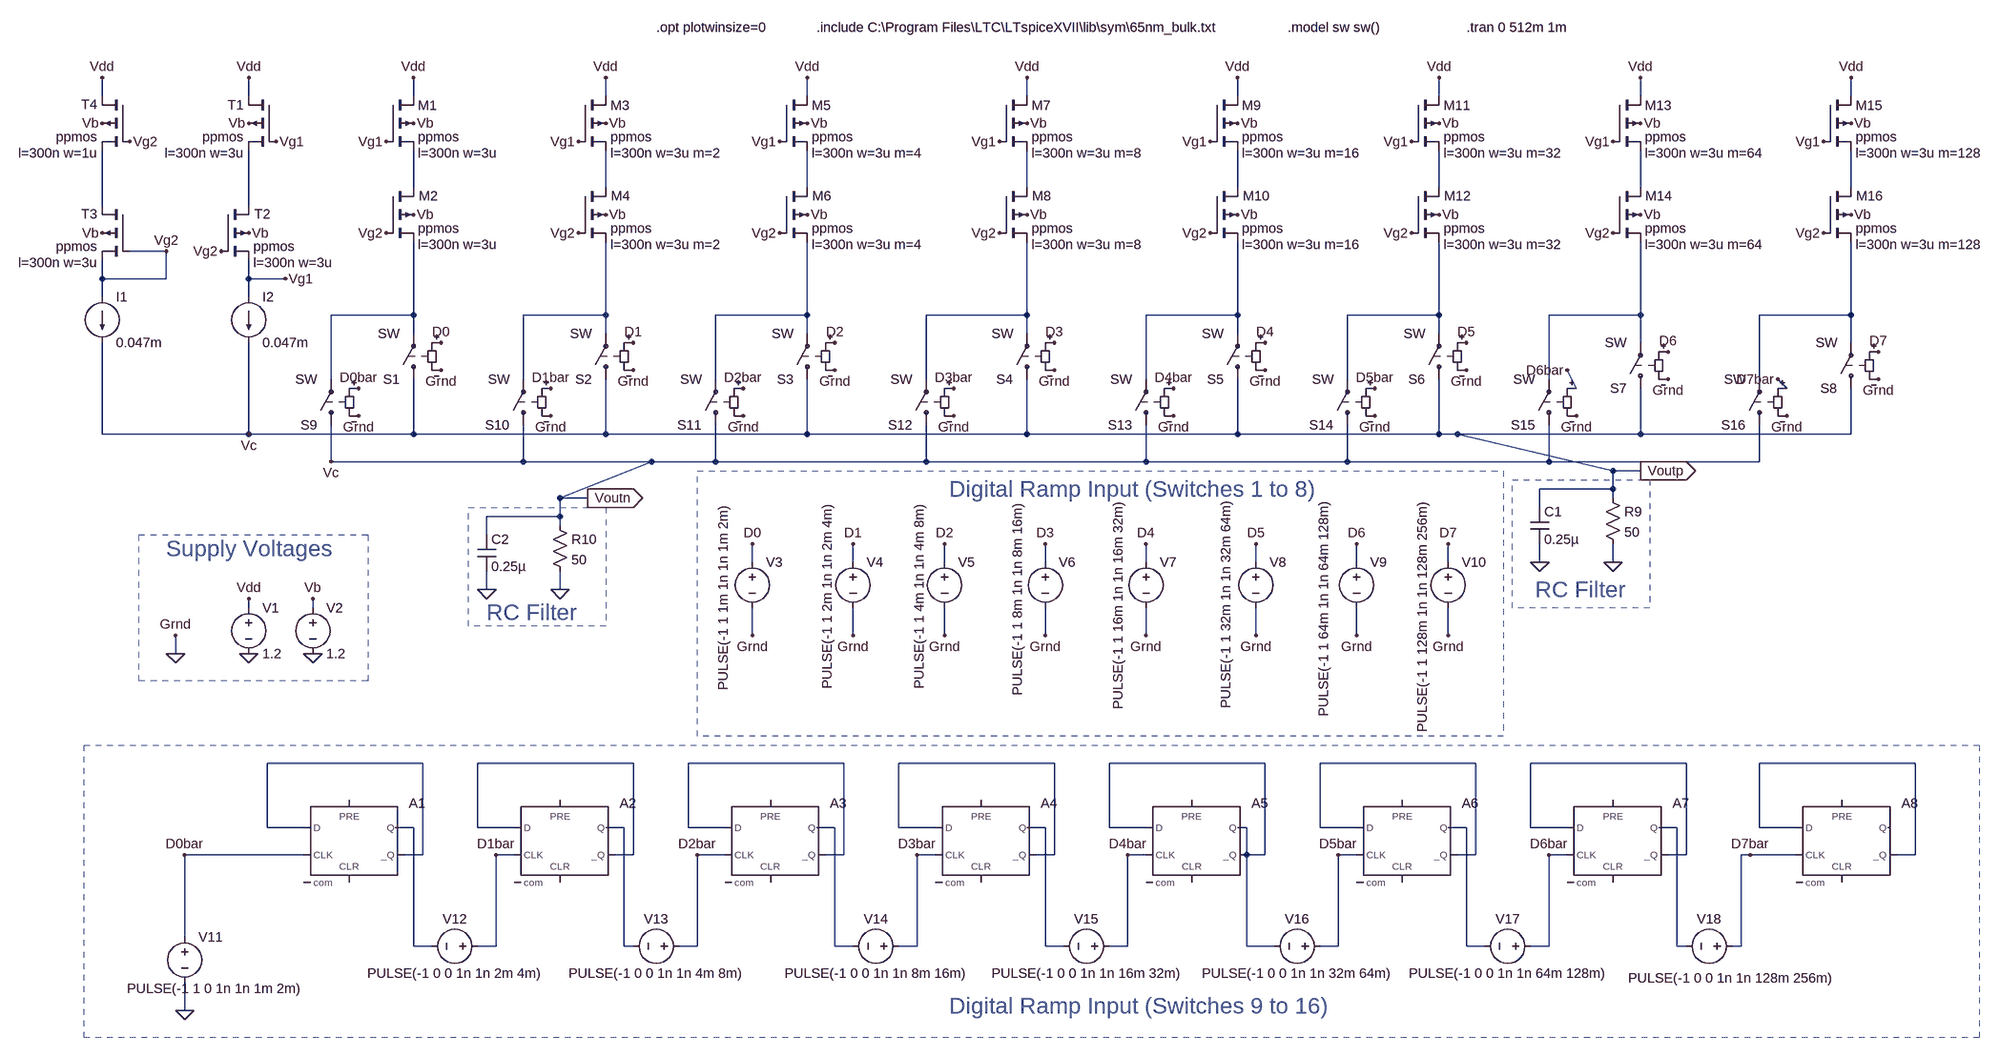
[diagram p0: schematic Differential DAC.asc]
Differential DAC.asc, the LTspice schematic file:
Version 4
SHEET 1 1784 1348
WIRE -1536 -304 -1536 -336
WIRE -1280 -304 -1280 -336
WIRE -992 -304 -992 -336
WIRE -656 -304 -656 -336
WIRE -304 -304 -304 -336
WIRE 80 -304 80 -336
WIRE 448 -304 448 -336
WIRE 800 -304 800 -336
WIRE 1152 -304 1152 -336
WIRE 1520 -304 1520 -336
WIRE -992 -144 -992 -208
WIRE -656 -144 -656 -208
WIRE -304 -144 -304 -208
WIRE 80 -144 80 -208
WIRE 448 -144 448 -208
WIRE 800 -144 800 -208
WIRE 1152 -144 1152 -208
WIRE 1520 -144 1520 -208
WIRE -1536 -112 -1536 -208
WIRE -1280 -112 -1280 -208
WIRE -1424 -32 -1488 -32
WIRE -1536 16 -1536 -16
WIRE -1424 16 -1424 -32
WIRE -1424 16 -1536 16
WIRE -1280 16 -1280 -16
WIRE -1216 16 -1280 16
WIRE -1536 48 -1536 16
WIRE -1280 48 -1280 16
WIRE -992 80 -992 -48
WIRE -992 80 -1136 80
WIRE -656 80 -656 -48
WIRE -656 80 -800 80
WIRE -304 80 -304 -48
WIRE -304 80 -464 80
WIRE 80 80 80 -48
WIRE 80 80 -96 80
WIRE 448 80 448 -48
WIRE 448 80 288 80
WIRE 800 80 800 -48
WIRE 800 80 640 80
WIRE 1152 80 1152 -48
WIRE 1152 80 992 80
WIRE 1520 80 1520 -48
WIRE 1520 80 1360 80
WIRE -992 112 -992 80
WIRE -656 112 -656 80
WIRE -304 112 -304 80
WIRE 80 112 80 80
WIRE 448 112 448 80
WIRE 800 112 800 80
WIRE 1152 128 1152 80
WIRE 1520 128 1520 80
WIRE -1136 192 -1136 80
WIRE -800 192 -800 80
WIRE -464 192 -464 80
WIRE -96 192 -96 80
WIRE 288 192 288 80
WIRE 640 192 640 80
WIRE 992 192 992 80
WIRE 1360 192 1360 80
WIRE 1040 208 1024 176
WIRE 1408 208 1392 192
WIRE -1536 288 -1536 128
WIRE -1280 288 -1280 128
WIRE -1280 288 -1536 288
WIRE -992 288 -992 192
WIRE -992 288 -1280 288
WIRE -656 288 -656 192
WIRE -656 288 -992 288
WIRE -304 288 -304 192
WIRE -304 288 -656 288
WIRE 80 288 80 192
WIRE 80 288 -304 288
WIRE 448 288 448 192
WIRE 448 288 80 288
WIRE 800 288 800 192
WIRE 800 288 448 288
WIRE 832 288 800 288
WIRE 1152 288 1152 208
WIRE 1152 288 832 288
WIRE 1520 288 1520 208
WIRE 1520 288 1152 288
WIRE -1136 336 -1136 272
WIRE -800 336 -800 272
WIRE -800 336 -1136 336
WIRE -576 336 -800 336
WIRE -464 336 -464 272
WIRE -464 336 -576 336
WIRE -96 336 -96 272
WIRE -96 336 -464 336
WIRE 288 336 288 272
WIRE 288 336 -96 336
WIRE 640 336 640 272
WIRE 640 336 288 336
WIRE 992 336 992 272
WIRE 992 336 640 336
WIRE 1360 336 1360 272
WIRE 1360 336 992 336
WIRE 1104 352 832 288
WIRE 1152 352 1104 352
WIRE 1104 384 1104 352
WIRE 1104 384 976 384
WIRE -736 400 -576 336
WIRE -688 400 -736 400
WIRE 1104 400 1104 384
WIRE 976 416 976 384
WIRE -736 432 -736 400
WIRE -736 432 -864 432
WIRE -736 448 -736 432
WIRE -864 464 -864 432
WIRE -400 512 -400 480
WIRE -224 512 -224 480
WIRE -64 512 -64 480
WIRE 112 512 112 480
WIRE 288 512 288 480
WIRE 480 512 480 480
WIRE 656 512 656 480
WIRE 816 512 816 480
WIRE 976 512 976 480
WIRE 1104 512 1104 480
WIRE -864 560 -864 528
WIRE -736 560 -736 528
WIRE -1280 592 -1280 576
WIRE -1168 592 -1168 576
WIRE -400 640 -400 592
WIRE -224 640 -224 592
WIRE -64 640 -64 592
WIRE 112 640 112 592
WIRE 288 640 288 592
WIRE 480 640 480 592
WIRE 656 640 656 592
WIRE 816 640 816 592
WIRE -1408 672 -1408 640
WIRE -976 864 -1248 864
WIRE -608 864 -880 864
WIRE -240 864 -512 864
WIRE 128 864 -144 864
WIRE 496 864 224 864
WIRE 864 864 592 864
WIRE 1232 864 960 864
WIRE 1632 864 1360 864
WIRE -1248 976 -1248 864
WIRE -1184 976 -1248 976
WIRE -992 976 -1024 976
WIRE -880 976 -880 864
WIRE -816 976 -880 976
WIRE -624 976 -656 976
WIRE -512 976 -512 864
WIRE -448 976 -512 976
WIRE -256 976 -288 976
WIRE -144 976 -144 864
WIRE -80 976 -144 976
WIRE 112 976 80 976
WIRE 224 976 224 864
WIRE 288 976 224 976
WIRE 464 976 448 976
WIRE 592 976 592 864
WIRE 656 976 592 976
WIRE 848 976 816 976
WIRE 960 976 960 864
WIRE 1024 976 960 976
WIRE 1216 976 1184 976
WIRE 1360 976 1360 864
WIRE 1424 976 1360 976
WIRE -1184 1024 -1392 1024
WIRE -976 1024 -976 864
WIRE -976 1024 -1008 1024
WIRE -816 1024 -848 1024
WIRE -608 1024 -608 864
WIRE -608 1024 -640 1024
WIRE -448 1024 -496 1024
WIRE -240 1024 -240 864
WIRE -240 1024 -272 1024
WIRE -80 1024 -112 1024
WIRE 128 1024 128 864
WIRE 128 1024 96 1024
WIRE 288 1024 256 1024
WIRE 464 1024 464 976
WIRE 496 1024 496 864
WIRE 496 1024 464 1024
WIRE 656 1024 624 1024
WIRE 864 1024 864 864
WIRE 864 1024 832 1024
WIRE 1024 1024 992 1024
WIRE 1232 1024 1232 864
WIRE 1232 1024 1200 1024
WIRE 1344 1024 1328 1024
WIRE 1424 1024 1344 1024
WIRE 1632 1024 1632 864
WIRE 1632 1024 1600 1024
WIRE -1392 1168 -1392 1024
WIRE -992 1184 -992 976
WIRE -960 1184 -992 1184
WIRE -848 1184 -848 1024
WIRE -848 1184 -880 1184
WIRE -624 1184 -624 976
WIRE -608 1184 -624 1184
WIRE -496 1184 -496 1024
WIRE -496 1184 -528 1184
WIRE -256 1184 -256 976
WIRE -224 1184 -256 1184
WIRE -112 1184 -112 1024
WIRE -112 1184 -144 1184
WIRE 112 1184 112 976
WIRE 144 1184 112 1184
WIRE 256 1184 256 1024
WIRE 256 1184 224 1184
WIRE 464 1184 464 1024
WIRE 512 1184 464 1184
WIRE 624 1184 624 1024
WIRE 624 1184 592 1184
WIRE 848 1184 848 976
WIRE 880 1184 848 1184
WIRE 992 1184 992 1024
WIRE 992 1184 960 1184
WIRE 1216 1184 1216 976
WIRE 1232 1184 1216 1184
WIRE 1328 1184 1328 1024
WIRE 1328 1184 1312 1184
WIRE -1392 1296 -1392 1248
FLAG -1536 -64 Vb
FLAG -1280 -64 Vb
FLAG -1536 -256 Vb
FLAG -1280 -256 Vb
FLAG -1280 -336 Vdd
FLAG -1536 -336 Vdd
FLAG -1488 -224 Vg2
FLAG -1424 -32 Vg2
FLAG -1232 -224 Vg1
FLAG -1216 16 Vg1
FLAG -992 -96 Vb
FLAG -992 -256 Vb
FLAG -992 -336 Vdd
FLAG -1040 -224 Vg1
FLAG -1040 -64 Vg2
FLAG -1328 -32 Vg2
FLAG -656 -96 Vb
FLAG -656 -256 Vb
FLAG -656 -336 Vdd
FLAG -704 -224 Vg1
FLAG -704 -64 Vg2
FLAG -304 -96 Vb
FLAG -304 -256 Vb
FLAG -304 -336 Vdd
FLAG -352 -224 Vg1
FLAG -352 -64 Vg2
FLAG 80 -96 Vb
FLAG 80 -256 Vb
FLAG 80 -336 Vdd
FLAG 32 -224 Vg1
FLAG 32 -64 Vg2
FLAG 448 -96 Vb
FLAG 448 -256 Vb
FLAG 448 -336 Vdd
FLAG 400 -224 Vg1
FLAG 400 -64 Vg2
FLAG 800 -96 Vb
FLAG 800 -256 Vb
FLAG 800 -336 Vdd
FLAG 752 -224 Vg1
FLAG 752 -64 Vg2
FLAG 1152 -96 Vb
FLAG 1152 -256 Vb
FLAG 1152 -336 Vdd
FLAG 1104 -224 Vg1
FLAG 1104 -64 Vg2
FLAG 1520 -96 Vb
FLAG 1520 -256 Vb
FLAG 1520 -336 Vdd
FLAG 1472 -224 Vg1
FLAG 1472 -64 Vg2
FLAG -1168 576 Vb
FLAG -1280 576 Vdd
FLAG -944 176 Grnd
FLAG -608 176 Grnd
FLAG -256 176 Grnd
FLAG 128 176 Grnd
FLAG 496 176 Grnd
FLAG 848 176 Grnd
FLAG 1200 192 Grnd
FLAG 1568 192 Grnd
FLAG -944 128 D0
FLAG -608 128 D1
FLAG -256 128 D2
FLAG 128 128 D3
FLAG 496 128 D4
FLAG 848 128 D5
FLAG 1200 144 D6
FLAG 1568 144 D7
FLAG 1152 352 Voutp
IOPIN 1152 352 Out
FLAG 1104 512 0
FLAG -1280 672 0
FLAG -1168 672 0
FLAG -1408 672 0
FLAG -1408 640 Grnd
FLAG 976 512 0
FLAG -1280 288 Vc
FLAG -688 400 Voutn
IOPIN -688 400 Out
FLAG -736 560 0
FLAG -864 560 0
FLAG -1088 256 Grnd
FLAG -752 256 Grnd
FLAG -416 256 Grnd
FLAG -48 256 Grnd
FLAG 336 256 Grnd
FLAG 688 256 Grnd
FLAG 1040 256 Grnd
FLAG 1408 256 Grnd
FLAG -1088 208 D0bar
FLAG -752 208 D1bar
FLAG -416 208 D2bar
FLAG -48 208 D3bar
FLAG 336 208 D4bar
FLAG 688 208 D5bar
FLAG 1024 176 D6bar
FLAG 1392 192 D7bar
FLAG -1136 336 Vc
FLAG -224 640 Grnd
FLAG -64 640 Grnd
FLAG 112 640 Grnd
FLAG 288 640 Grnd
FLAG 480 640 Grnd
FLAG 656 640 Grnd
FLAG 816 640 Grnd
FLAG -400 640 Grnd
FLAG -400 480 D0
FLAG -224 480 D1
FLAG -64 480 D2
FLAG 112 480 D3
FLAG 288 480 D4
FLAG 480 480 D5
FLAG 656 480 D6
FLAG 816 480 D7
FLAG -1392 1024 D0bar
FLAG -1392 1296 0
FLAG 1344 1024 D7bar
FLAG -848 1024 D1bar
FLAG -496 1024 D2bar
FLAG -112 1024 D3bar
FLAG 256 1024 D4bar
FLAG 624 1024 D5bar
FLAG 992 1024 D6bar
SYMBOL pmos4 -1232 -304 M0
WINDOW 0 56 16 Left 2
WINDOW 123 56 100 Left 2
SYMATTR InstName T1
SYMATTR Value2 l=300n w=3u
SYMATTR Value ppmos
SYMBOL pmos4 -1328 -112 R0
WINDOW 0 58 15 Left 2
WINDOW 123 56 100 Left 2
SYMATTR InstName T2
SYMATTR Value2 l=300n w=3u
SYMATTR Value ppmos
SYMBOL pmos4 -1488 -112 M0
WINDOW 0 56 15 Left 2
WINDOW 123 56 100 Left 2
SYMATTR InstName T3
SYMATTR Value2 l=300n w=3u
SYMATTR Value ppmos
SYMBOL current -1536 48 R0
WINDOW 123 0 0 Left 0
WINDOW 39 0 0 Left 0
SYMATTR InstName I1
SYMATTR Value 0.047m
SYMBOL current -1280 48 R0
WINDOW 123 0 0 Left 0
WINDOW 39 0 0 Left 0
SYMATTR InstName I2
SYMATTR Value 0.047m
SYMBOL pmos4 -1488 -304 M0
WINDOW 0 56 15 Left 2
WINDOW 123 56 100 Left 2
SYMATTR InstName T4
SYMATTR Value2 l=300n w=1u
SYMATTR Value ppmos
SYMBOL pmos4 -1040 -304 R0
WINDOW 0 56 17 Left 2
WINDOW 123 56 100 Left 2
SYMATTR InstName M1
SYMATTR Value2 l=300n w=3u
SYMATTR Value ppmos
SYMBOL pmos4 -1040 -144 R0
WINDOW 0 57 15 Left 2
WINDOW 123 56 100 Left 2
SYMATTR InstName M2
SYMATTR Value2 l=300n w=3u
SYMATTR Value ppmos
SYMBOL pmos4 -704 -304 R0
WINDOW 0 56 17 Left 2
WINDOW 123 56 100 Left 2
SYMATTR InstName M3
SYMATTR Value2 l=300n w=3u m=2
SYMATTR Value ppmos
SYMBOL pmos4 -704 -144 R0
WINDOW 0 57 15 Left 2
WINDOW 123 56 100 Left 2
SYMATTR InstName M4
SYMATTR Value2 l=300n w=3u m=2
SYMATTR Value ppmos
SYMBOL pmos4 -352 -304 R0
WINDOW 0 56 17 Left 2
WINDOW 123 56 100 Left 2
SYMATTR InstName M5
SYMATTR Value2 l=300n w=3u m=4
SYMATTR Value ppmos
SYMBOL pmos4 -352 -144 R0
WINDOW 0 57 15 Left 2
WINDOW 123 56 100 Left 2
SYMATTR InstName M6
SYMATTR Value2 l=300n w=3u m=4
SYMATTR Value ppmos
SYMBOL pmos4 32 -304 R0
WINDOW 0 56 17 Left 2
WINDOW 123 56 100 Left 2
SYMATTR InstName M7
SYMATTR Value2 l=300n w=3u m=8
SYMATTR Value ppmos
SYMBOL pmos4 32 -144 R0
WINDOW 0 57 15 Left 2
WINDOW 123 56 100 Left 2
SYMATTR InstName M8
SYMATTR Value2 l=300n w=3u m=8
SYMATTR Value ppmos
SYMBOL pmos4 400 -304 R0
WINDOW 0 56 17 Left 2
WINDOW 123 56 100 Left 2
SYMATTR InstName M9
SYMATTR Value2 l=300n w=3u m=16
SYMATTR Value ppmos
SYMBOL pmos4 400 -144 R0
WINDOW 0 57 15 Left 2
WINDOW 123 56 100 Left 2
SYMATTR InstName M10
SYMATTR Value2 l=300n w=3u m=16
SYMATTR Value ppmos
SYMBOL pmos4 752 -304 R0
WINDOW 0 56 17 Left 2
WINDOW 123 56 100 Left 2
SYMATTR InstName M11
SYMATTR Value2 l=300n w=3u m=32
SYMATTR Value ppmos
SYMBOL pmos4 752 -144 R0
WINDOW 0 57 15 Left 2
WINDOW 123 56 100 Left 2
SYMATTR InstName M12
SYMATTR Value2 l=300n w=3u m=32
SYMATTR Value ppmos
SYMBOL pmos4 1104 -304 R0
WINDOW 0 56 17 Left 2
WINDOW 123 56 100 Left 2
SYMATTR InstName M13
SYMATTR Value2 l=300n w=3u m=64
SYMATTR Value ppmos
SYMBOL pmos4 1104 -144 R0
WINDOW 0 57 15 Left 2
WINDOW 123 56 100 Left 2
SYMATTR InstName M14
SYMATTR Value2 l=300n w=3u m=64
SYMATTR Value ppmos
SYMBOL pmos4 1472 -304 R0
WINDOW 0 56 17 Left 2
WINDOW 123 56 100 Left 2
SYMATTR InstName M15
SYMATTR Value2 l=300n w=3u m=128
SYMATTR Value ppmos
SYMBOL pmos4 1472 -144 R0
WINDOW 0 57 15 Left 2
WINDOW 123 56 100 Left 2
SYMATTR InstName M16
SYMATTR Value2 l=300n w=3u m=128
SYMATTR Value ppmos
SYMBOL voltage -1280 576 R0
WINDOW 123 0 0 Left 0
WINDOW 39 0 0 Left 0
SYMATTR InstName V1
SYMATTR Value 1.2
SYMBOL voltage -1168 576 R0
WINDOW 123 0 0 Left 0
WINDOW 39 0 0 Left 0
SYMATTR InstName V2
SYMATTR Value 1.2
SYMBOL sw -992 208 R180
SYMATTR InstName S1
SYMBOL sw -656 208 R180
SYMATTR InstName S2
SYMBOL sw 80 208 R180
SYMATTR InstName S4
SYMBOL sw 448 208 R180
SYMATTR InstName S5
SYMBOL sw 800 208 R180
SYMATTR InstName S6
SYMBOL sw 1152 224 R180
SYMATTR InstName S7
SYMBOL sw 1520 224 R180
SYMATTR InstName S8
SYMBOL sw -304 208 R180
SYMATTR InstName S3
SYMBOL res 1088 384 R0
SYMATTR InstName R9
SYMATTR Value 50
SYMBOL cap 960 416 R0
SYMATTR InstName C1
SYMATTR Value 0.25µ
SYMBOL sw -1136 288 R180
SYMATTR InstName S9
SYMBOL sw -800 288 R180
SYMATTR InstName S10
SYMBOL sw -464 288 R180
SYMATTR InstName S11
SYMBOL sw -96 288 R180
SYMATTR InstName S12
SYMBOL sw 288 288 R180
SYMATTR InstName S13
SYMBOL sw 640 288 R180
SYMATTR InstName S14
SYMBOL sw 992 288 R180
SYMATTR InstName S15
SYMBOL sw 1360 288 R180
SYMATTR InstName S16
SYMBOL res -752 432 R0
SYMATTR InstName R10
SYMATTR Value 50
SYMBOL cap -880 464 R0
SYMATTR InstName C2
SYMATTR Value 0.25µ
SYMBOL voltage -400 496 R0
WINDOW 3 -50 -85 VRight 2
WINDOW 123 0 0 Left 0
WINDOW 39 0 0 Left 0
SYMATTR Value PULSE(-1 1 1m 1n 1n 1m 2m)
SYMATTR InstName V3
SYMBOL voltage -224 496 R0
WINDOW 3 -45 -87 VRight 2
WINDOW 123 0 0 Left 0
WINDOW 39 0 0 Left 0
SYMATTR Value PULSE(-1 1 2m 1n 1n 2m 4m)
SYMATTR InstName V4
SYMBOL voltage -64 496 R0
WINDOW 3 -44 -87 VRight 2
WINDOW 123 0 0 Left 0
WINDOW 39 0 0 Left 0
SYMATTR Value PULSE(-1 1 4m 1n 1n 4m 8m)
SYMATTR InstName V5
SYMBOL voltage 112 496 R0
WINDOW 3 -48 -89 VRight 2
WINDOW 123 0 0 Left 0
WINDOW 39 0 0 Left 0
SYMATTR Value PULSE(-1 1 8m 1n 1n 8m 16m)
SYMATTR InstName V6
SYMBOL voltage 288 496 R0
WINDOW 3 -48 -92 VRight 2
WINDOW 123 0 0 Left 0
WINDOW 39 0 0 Left 0
SYMATTR Value PULSE(-1 1 16m 1n 1n 16m 32m)
SYMATTR InstName V7
SYMBOL voltage 480 496 R0
WINDOW 3 -52 -94 VRight 2
WINDOW 123 0 0 Left 0
WINDOW 39 0 0 Left 0
SYMATTR Value PULSE(-1 1 32m 1n 1n 32m 64m)
SYMATTR InstName V8
SYMBOL voltage 656 496 R0
WINDOW 3 -57 -93 VRight 2
WINDOW 123 0 0 Left 0
WINDOW 39 0 0 Left 0
SYMATTR Value PULSE(-1 1 64m 1n 1n 64m 128m)
SYMATTR InstName V9
SYMBOL voltage 816 496 R0
WINDOW 3 -45 -92 VRight 2
WINDOW 123 0 0 Left 0
WINDOW 39 0 0 Left 0
SYMATTR Value PULSE(-1 1 128m 1n 1n 128m 256m)
SYMATTR InstName V10
SYMBOL Digital\\dflop -1104 928 R0
SYMATTR InstName A1
SYMBOL Digital\\dflop -736 928 R0
SYMATTR InstName A2
SYMBOL Digital\\dflop -368 928 R0
SYMATTR InstName A3
SYMBOL Digital\\dflop 0 928 R0
SYMATTR InstName A4
SYMBOL Digital\\dflop 368 928 R0
SYMATTR InstName A5
SYMBOL Digital\\dflop 736 928 R0
SYMATTR InstName A6
SYMBOL Digital\\dflop 1104 928 R0
SYMATTR InstName A7
SYMBOL Digital\\dflop 1504 928 R0
SYMATTR InstName A8
SYMBOL voltage -1392 1152 R0
WINDOW 123 0 0 Left 0
WINDOW 39 0 0 Left 0
WINDOW 3 -101 106 Left 2
SYMATTR Value PULSE(-1 1 0 1n 1n 1m 2m)
SYMATTR InstName V11
SYMBOL voltage -864 1184 R90
WINDOW 0 -32 56 VBottom 2
WINDOW 3 32 56 VTop 2
WINDOW 123 0 0 Left 0
WINDOW 39 0 0 Left 0
SYMATTR InstName V12
SYMATTR Value PULSE(-1 0 0 1n 1n 2m 4m)
SYMBOL voltage -512 1184 R90
WINDOW 0 -32 56 VBottom 2
WINDOW 3 32 56 VTop 2
WINDOW 123 0 0 Left 0
WINDOW 39 0 0 Left 0
SYMATTR InstName V13
SYMATTR Value PULSE(-1 0 0 1n 1n 4m 8m)
SYMBOL voltage -128 1184 R90
WINDOW 0 -32 56 VBottom 2
WINDOW 3 32 56 VTop 2
WINDOW 123 0 0 Left 0
WINDOW 39 0 0 Left 0
SYMATTR InstName V14
SYMATTR Value PULSE(-1 0 0 1n 1n 8m 16m)
SYMBOL voltage 240 1184 R90
WINDOW 0 -32 56 VBottom 2
WINDOW 3 32 56 VTop 2
WINDOW 123 0 0 Left 0
WINDOW 39 0 0 Left 0
SYMATTR InstName V15
SYMATTR Value PULSE(-1 0 0 1n 1n 16m 32m)
SYMBOL voltage 608 1184 R90
WINDOW 0 -32 56 VBottom 2
WINDOW 3 32 56 VTop 2
WINDOW 123 0 0 Left 0
WINDOW 39 0 0 Left 0
SYMATTR InstName V16
SYMATTR Value PULSE(-1 0 0 1n 1n 32m 64m)
SYMBOL voltage 976 1184 R90
WINDOW 0 -32 56 VBottom 2
WINDOW 3 32 56 VTop 2
WINDOW 123 0 0 Left 0
WINDOW 39 0 0 Left 0
SYMATTR InstName V17
SYMATTR Value PULSE(-1 0 0 1n 1n 64m 128m)
SYMBOL voltage 1328 1184 R90
WINDOW 0 -32 56 VBottom 2
WINDOW 3 40 18 VTop 2
WINDOW 123 0 0 Left 0
WINDOW 39 0 0 Left 0
SYMATTR InstName V18
SYMATTR Value PULSE(-1 0 0 1n 1n 128m 256m)
TEXT -288 -424 Left 2 !.include C:\\Program Files\\LTC\\LTspiceXVII\\lib\\sym\\65nm_bulk.txt
TEXT -568 -424 Left 2 !.opt plotwinsize=0
TEXT 536 -424 Left 2 !.model sw sw()
TEXT 848 -424 Left 2 !.tran 0 512m 1m
TEXT 968 560 Left 4 ;RC Filter
TEXT -864 600 Left 4 ;RC Filter
TEXT -1424 488 Left 4 ;Supply Voltages
TEXT -56 384 Left 4 ;Digital Ramp Input (Switches 1 to 8)
TEXT -56 1288 Left 4 ;Digital Ramp Input (Switches 9 to 16)
RECTANGLE Normal 1168 592 928 368 2
RECTANGLE Normal -656 624 -896 416 2
RECTANGLE Normal -1072 720 -1472 464 2
RECTANGLE Normal 1744 1344 -1568 832 2
RECTANGLE Normal 912 816 -496 352 2

The netlist it stands for:
* Differential DAC.asc
M§T1 Vdd Vg1 N010 Vb ppmos l=300n w=3u
M§T2 N010 Vg2 Vg1 Vb ppmos l=300n w=3u
M§T3 N009 Vg2 Vg2 Vb ppmos l=300n w=3u
I1 Vg2 Voutn 0.047m
I2 Vg1 Voutn 0.047m
M§T4 Vdd Vg2 N009 Vb ppmos l=300n w=1u
M1 Vdd Vg1 N001 Vb ppmos l=300n w=3u
M2 N001 Vg2 N011 Vb ppmos l=300n w=3u
M3 Vdd Vg1 N002 Vb ppmos l=300n w=3u m=2
M4 N002 Vg2 N012 Vb ppmos l=300n w=3u m=2
M5 Vdd Vg1 N003 Vb ppmos l=300n w=3u m=4
M6 N003 Vg2 N013 Vb ppmos l=300n w=3u m=4
M7 Vdd Vg1 N004 Vb ppmos l=300n w=3u m=8
M8 N004 Vg2 N014 Vb ppmos l=300n w=3u m=8
M9 Vdd Vg1 N005 Vb ppmos l=300n w=3u m=16
M10 N005 Vg2 N015 Vb ppmos l=300n w=3u m=16
M11 Vdd Vg1 N006 Vb ppmos l=300n w=3u m=32
M12 N006 Vg2 N016 Vb ppmos l=300n w=3u m=32
M13 Vdd Vg1 N007 Vb ppmos l=300n w=3u m=64
M14 N007 Vg2 N017 Vb ppmos l=300n w=3u m=64
M15 Vdd Vg1 N008 Vb ppmos l=300n w=3u m=128
M16 N008 Vg2 N018 Vb ppmos l=300n w=3u m=128
V1 Vdd 0 1.2
V2 Vb 0 1.2
S1 Voutn N011 D0 0 SW
S2 Voutn N012 D1 0 SW
S4 Voutn N014 D3 0 SW
S5 Voutn N015 D4 0 SW
S6 Voutn N016 D5 0 SW
S7 Voutn N017 D6 0 SW
S8 Voutn N018 D7 0 SW
S3 Voutn N013 D2 0 SW
R9 Voutn 0 50
C1 Voutn 0 0.25µ
S9 Voutn N011 D0bar 0 SW
S10 Voutn N012 D1bar 0 SW
S11 Voutn N013 D2bar 0 SW
S12 Voutn N014 D3bar 0 SW
S13 Voutn N015 D4bar 0 SW
S14 Voutn N016 D5bar 0 SW
S15 Voutn N017 D6bar 0 SW
S16 Voutn N018 D7bar 0 SW
R10 Voutn 0 50
C2 Voutn 0 0.25µ
V3 D0 0 PULSE(-1 1 1m 1n 1n 1m 2m)
V4 D1 0 PULSE(-1 1 2m 1n 1n 2m 4m)
V5 D2 0 PULSE(-1 1 4m 1n 1n 4m 8m)
V6 D3 0 PULSE(-1 1 8m 1n 1n 8m 16m)
V7 D4 0 PULSE(-1 1 16m 1n 1n 16m 32m)
V8 D5 0 PULSE(-1 1 32m 1n 1n 32m 64m)
V9 D6 0 PULSE(-1 1 64m 1n 1n 64m 128m)
V10 D7 0 PULSE(-1 1 128m 1n 1n 128m 256m)
A1 N019 0 D0bar 0 0 N019 N027 0 DFLOP
A2 N020 0 D1bar 0 0 N020 N028 0 DFLOP
A3 N021 0 D2bar 0 0 N021 N029 0 DFLOP
A4 N022 0 D3bar 0 0 N022 N030 0 DFLOP
A5 N023 0 D4bar 0 0 N023 N023 0 DFLOP
A6 N024 0 D5bar 0 0 N024 N031 0 DFLOP
A7 N025 0 D6bar 0 0 N025 N032 0 DFLOP
A8 N026 0 D7bar 0 0 N026 0 0 DFLOP
V11 D0bar 0 PULSE(-1 1 0 1n 1n 1m 2m)
V12 D1bar N027 PULSE(-1 0 0 1n 1n 2m 4m)
V13 D2bar N028 PULSE(-1 0 0 1n 1n 4m 8m)
V14 D3bar N029 PULSE(-1 0 0 1n 1n 8m 16m)
V15 D4bar N030 PULSE(-1 0 0 1n 1n 16m 32m)
V16 D5bar N023 PULSE(-1 0 0 1n 1n 32m 64m)
V17 D6bar N031 PULSE(-1 0 0 1n 1n 64m 128m)
V18 D7bar N032 PULSE(-1 0 0 1n 1n 128m 256m)
.model NMOS NMOS
.model PMOS PMOS
.lib standard.mos
.include C:\Program Files\LTC\LTspiceXVII\lib\sym\65nm_bulk.txt
.opt plotwinsize=0
.model sw sw()
.tran 0 512m 1m
* RC Filter
* RC Filter
* Supply Voltages
* Digital Ramp Input (Switches 1 to 8)
* Digital Ramp Input (Switches 9 to 16)
.backanno
.end